# EAGLE schematic esp32_rf (EAGLE 9.6.2)

## Sheet 1 of 3
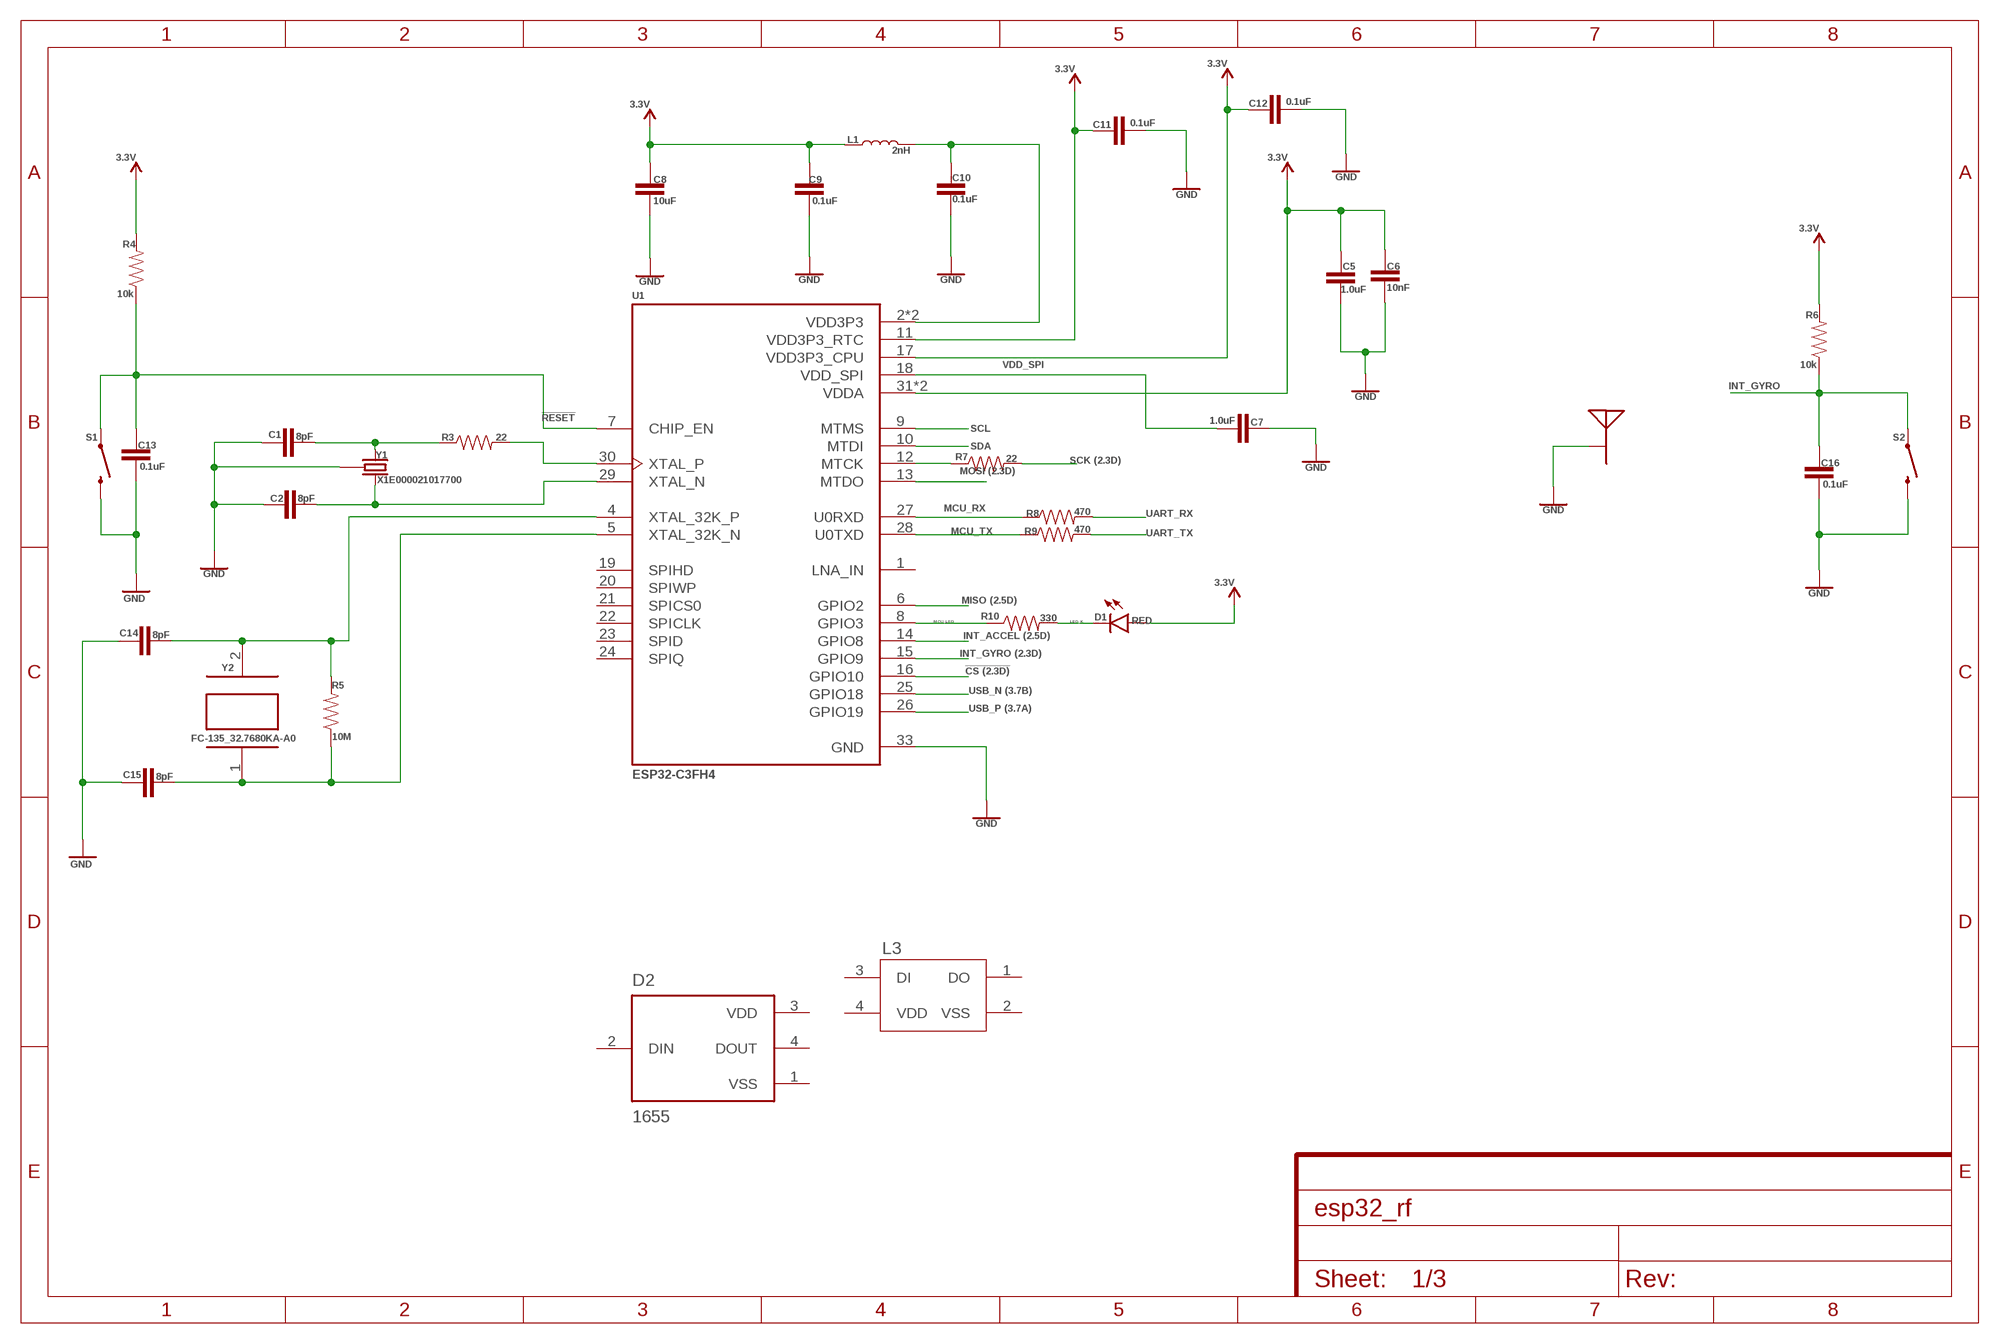
[diagram p0: schematic, sheet 1]

### Parts
C1  8pF  12PF-0603-50V-5%  [0603]
C2  8pF  12PF-0603-50V-5%  [0603]
C5  1.0uF  1.0UF-0603-16V-10%  [0603]
C6  10nF  10NF-0603-50V-10%  [0603]
C7  1.0uF  1.0UF-0603-16V-10%  [0603]
C8  10uF  10UF-0603-6.3V-20%  [0603]
C9  0.1uF  0.1UF-0603-25V-(+80/-20%)  [0603]
C10  0.1uF  0.1UF-0603-25V-(+80/-20%)  [0603]
C11  0.1uF  0.1UF-0603-25V-(+80/-20%)  [0603]
C12  0.1uF  0.1UF-0603-25V-(+80/-20%)  [0603]
C13  0.1uF  0.1UF-0603-25V-(+80/-20%)  [0603]
C14  8pF  12PF-0603-50V-5%  [0603]
C15  8pF  12PF-0603-50V-5%  [0603]
C16  0.1uF  0.1UF-0603-25V-(+80/-20%)  [0603]
D1  RED  LED0603  [LED-0603]
D2  1655  [LED_1655]
L1  2nH  INDUCTOR-0603-33NH  [0603]
L3  WS2812B-2020  [WS2812B-2020]
R3  22  22OHM-0603-1/10W-1%  [0603]
R4  10k  10KOHM-0603-1/10W-1%  [0603]
R5  10M  10MOHM-0603-1/10W-5%  [0603]
R6  10k  10KOHM-0603-1/10W-1%  [0603]
R7  22  22OHM-0603-1/10W-1%  [0603]
R8  470  470OHM-0603-1/10W-1%  [0603]
R9  470  470OHM-0603-1/10W-1%  [0603]
R10  330  330OHM-0603-1/10W-1%  [0603]
S1  MOMENTARY-SWITCH-SPST-SMD-4.6X2.8MM  [TACTILE_SWITCH_SMD_4.6X2.8MM]
S2  MOMENTARY-SWITCH-SPST-SMD-4.6X2.8MM  [TACTILE_SWITCH_SMD_4.6X2.8MM]
U1  ESP32-C3FH4  [QFN50P500X500X90-33N]
U$1  MEANDER-ANT  [MEANDER-ANT]
Y1  X1E000021017700  CRYSTAL-26MHZSMD-3.2X2.5  [CRYSTAL-SMD-3.2X2.5MM]
Y2  FC-135_32.7680KA-A0  [XTAL_FC-135_32.7680KA-A0]

### Nets
3.3V: C5.1 C6.1 C8.1 C9.2 C11.2 C12.2 D1.A L1.1 R4.2 R6.2 U1.11(VDD3P3_RTC) U1.17(VDD3P3_CPU) U1.31(VDDA) U1.32(VDDA) ; also sheet 2,3
!CS: U1.16(GPIO10) ; also sheet 2
!RESET: C13.1 R4.1 S1.1 S1.2 U1.7(CHIP_EN)
GND: C1.1 C2.1 C5.2 C6.2 C7.1 C8.2 C9.1 C10.1 C11.1 C12.1 C13.2 C14.1 C15.1 C16.2 S1.3 S1.4 S2.3 S2.4 U1.33(GND) U$1.GND Y1.2 Y1.4 ; also sheet 2,3
INT_ACCEL: U1.14(GPIO8) ; also sheet 2
INT_GYRO: C16.1 R6.1 S2.1 S2.2 U1.15(GPIO9) ; also sheet 2
LED_K: D1.C R10.2
MCU_LED: R10.1 U1.8(GPIO3)
MCU_RX: R8.1 U1.27(U0RXD)
MCU_TX: R9.1 U1.28(U0TXD)
MISO: U1.6(GPIO2) ; also sheet 2
MOSI: U1.13(MTDO) ; also sheet 2
N$3: R3.2 U1.30(XTAL_P)
N$4: C1.2 R3.1 Y1.1
N$5: C2.2 U1.29(XTAL_N) Y1.3
N$6: C10.2 L1.2 U1.2(VDD3P3) U1.3(VDD3P3)
N$12: C14.2 R5.2 U1.4(XTAL_32K_P) Y2.2
N$13: C15.2 R5.1 U1.5(XTAL_32K_N) Y2.1
N$15: R7.1 U1.12(MTCK)
SCK: R7.2 ; also sheet 2
SCL: U1.9(MTMS) ; also sheet 2
SDA: U1.10(MTDI) ; also sheet 2
UART_RX: R8.2 ; also sheet 3
UART_TX: R9.2 ; also sheet 3
USB_N: U1.25(GPIO18) ; also sheet 3
USB_P: U1.26(GPIO19) ; also sheet 3
VDD_SPI: C7.2 U1.18(VDD_SPI)
Unconnected: D2.2(DIN) D2.4(DOUT) L3.1(DO) L3.2(VSS) L3.3(DI) L3.4(VDD) U1.1(LNA_IN) U1.19(SPIHD) U1.20(SPIWP) U1.21(SPICS0) U1.22(SPICLK) U1.23(SPID) U1.24(SPIQ) U$1.FEED

## Sheet 2 of 3
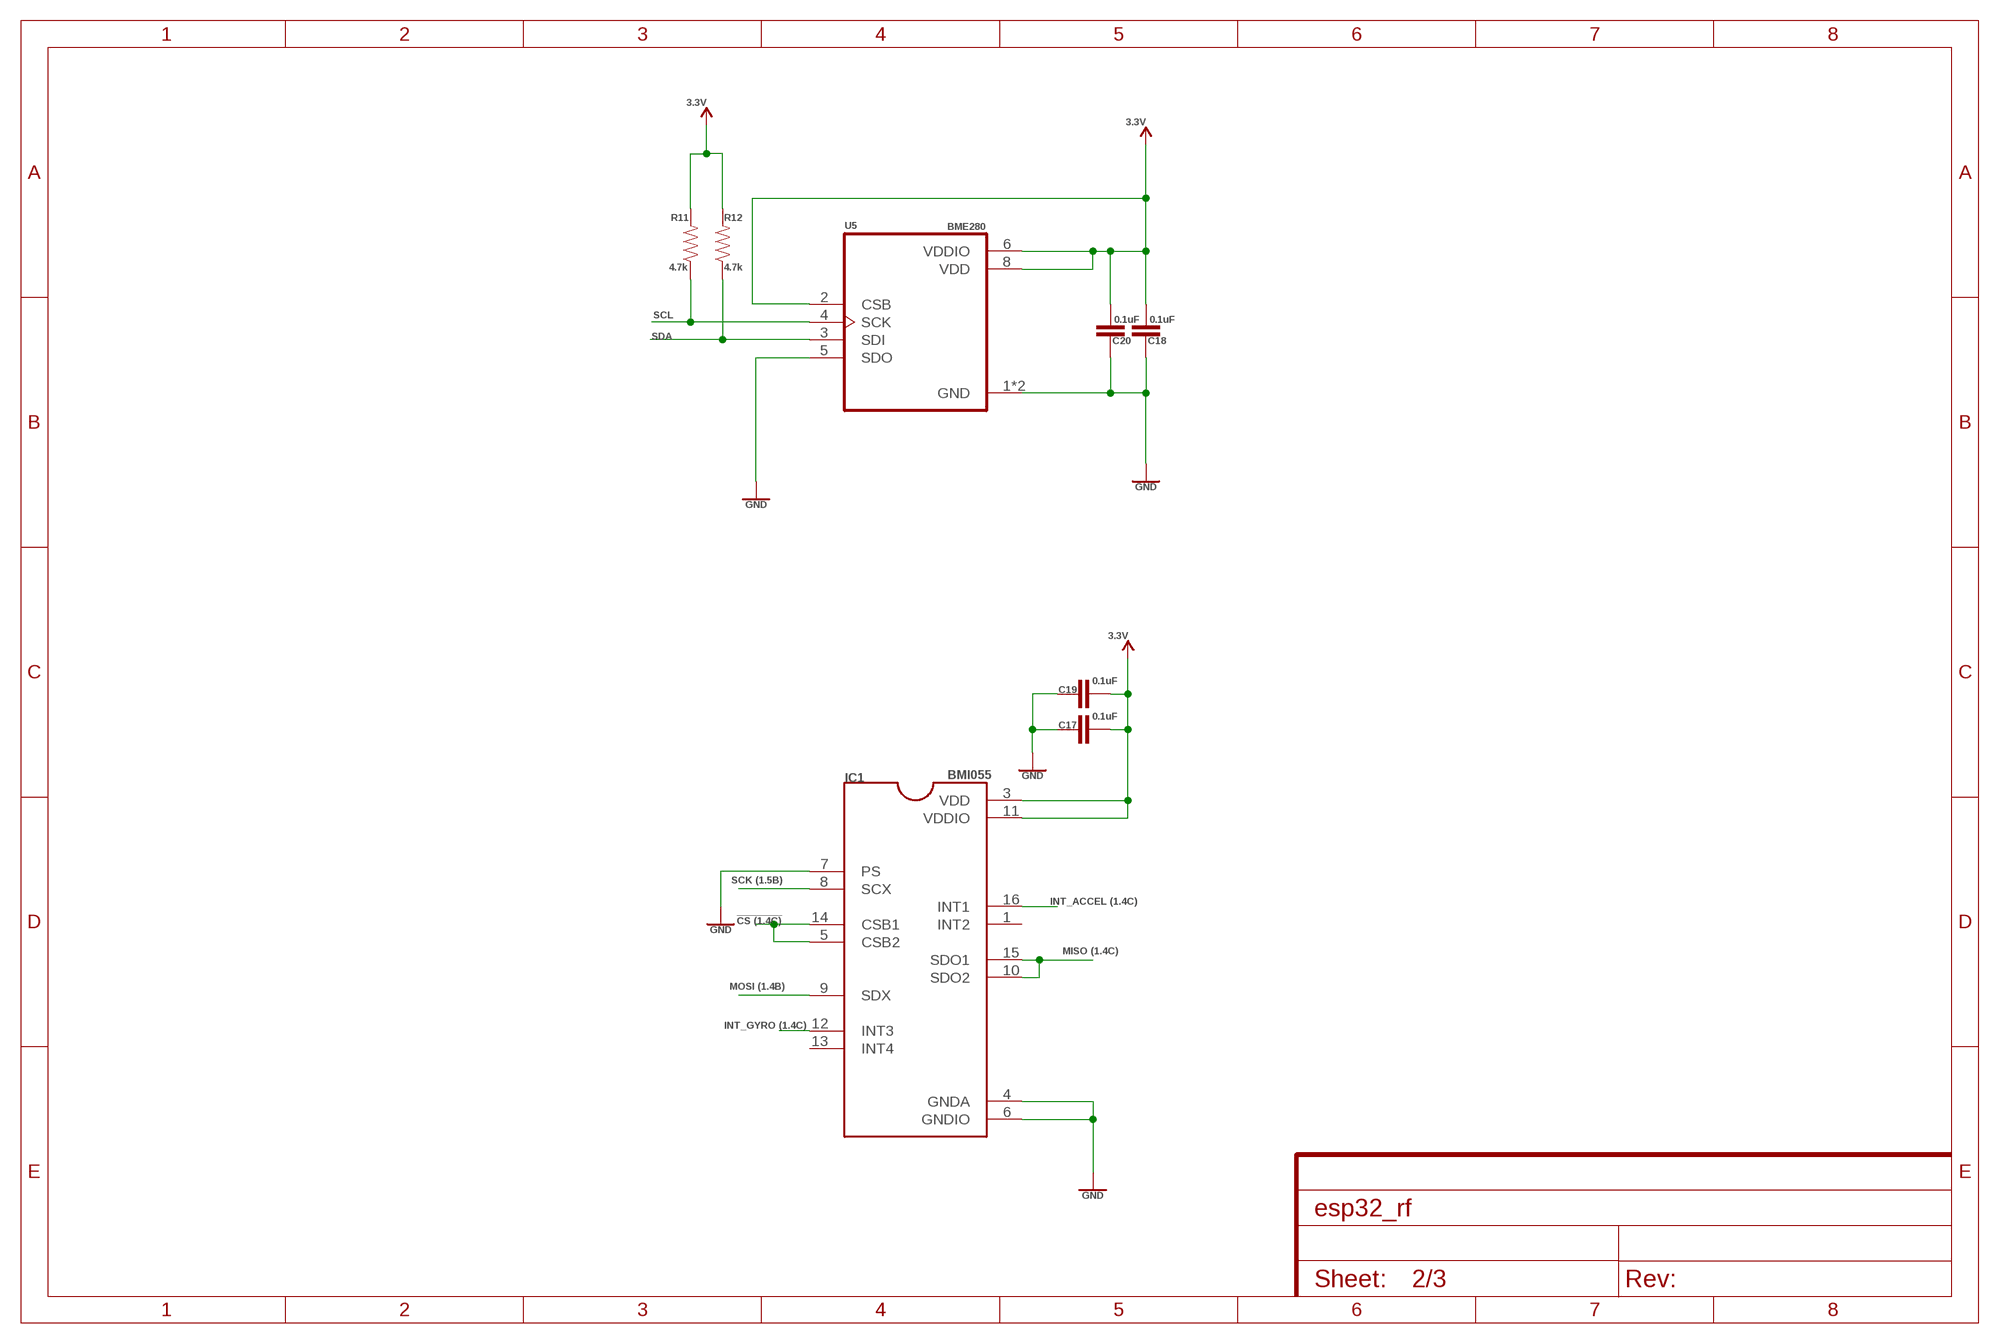
[diagram p1: schematic, sheet 2]

### Parts
C17  0.1uF  0.1UF-0603-25V-(+80/-20%)  [0603]
C18  0.1uF  0.1UF-0603-25V-(+80/-20%)  [0603]
C19  0.1uF  0.1UF-0603-25V-(+80/-20%)  [0603]
C20  0.1uF  0.1UF-0603-25V-(+80/-20%)  [0603]
IC1  BMI055  [QFN50P300X450X100-16N]
R11  4.7k  4.7KOHM-0603-1/10W-1%  [0603]
R12  4.7k  4.7KOHM-0603-1/10W-1%  [0603]
U5  BME280  [PSON65P250X250X100-8N]

### Nets
3.3V: C17.2 C18.2 C19.2 C20.2 IC1.3(VDD) IC1.11(VDDIO) R11.2 R12.2 U5.2(CSB) U5.6(VDDIO) U5.8(VDD) ; also sheet 1,3
!CS: IC1.5(CSB2) IC1.14(CSB1) ; also sheet 1
GND: C17.1 C18.1 C19.1 C20.1 IC1.4(GNDA) IC1.6(GNDIO) IC1.7(PS) U5.1(GND) U5.5(SDO) U5.7(GND) ; also sheet 1,3
INT_ACCEL: IC1.16(INT1) ; also sheet 1
INT_GYRO: IC1.12(INT3) ; also sheet 1
MISO: IC1.10(SDO2) IC1.15(SDO1) ; also sheet 1
MOSI: IC1.9(SDX) ; also sheet 1
SCK: IC1.8(SCX) ; also sheet 1
SCL: R11.1 U5.4(SCK) ; also sheet 1
SDA: R12.1 U5.3(SDI) ; also sheet 1
Unconnected: IC1.1(INT2) IC1.13(INT4)

## Sheet 3 of 3
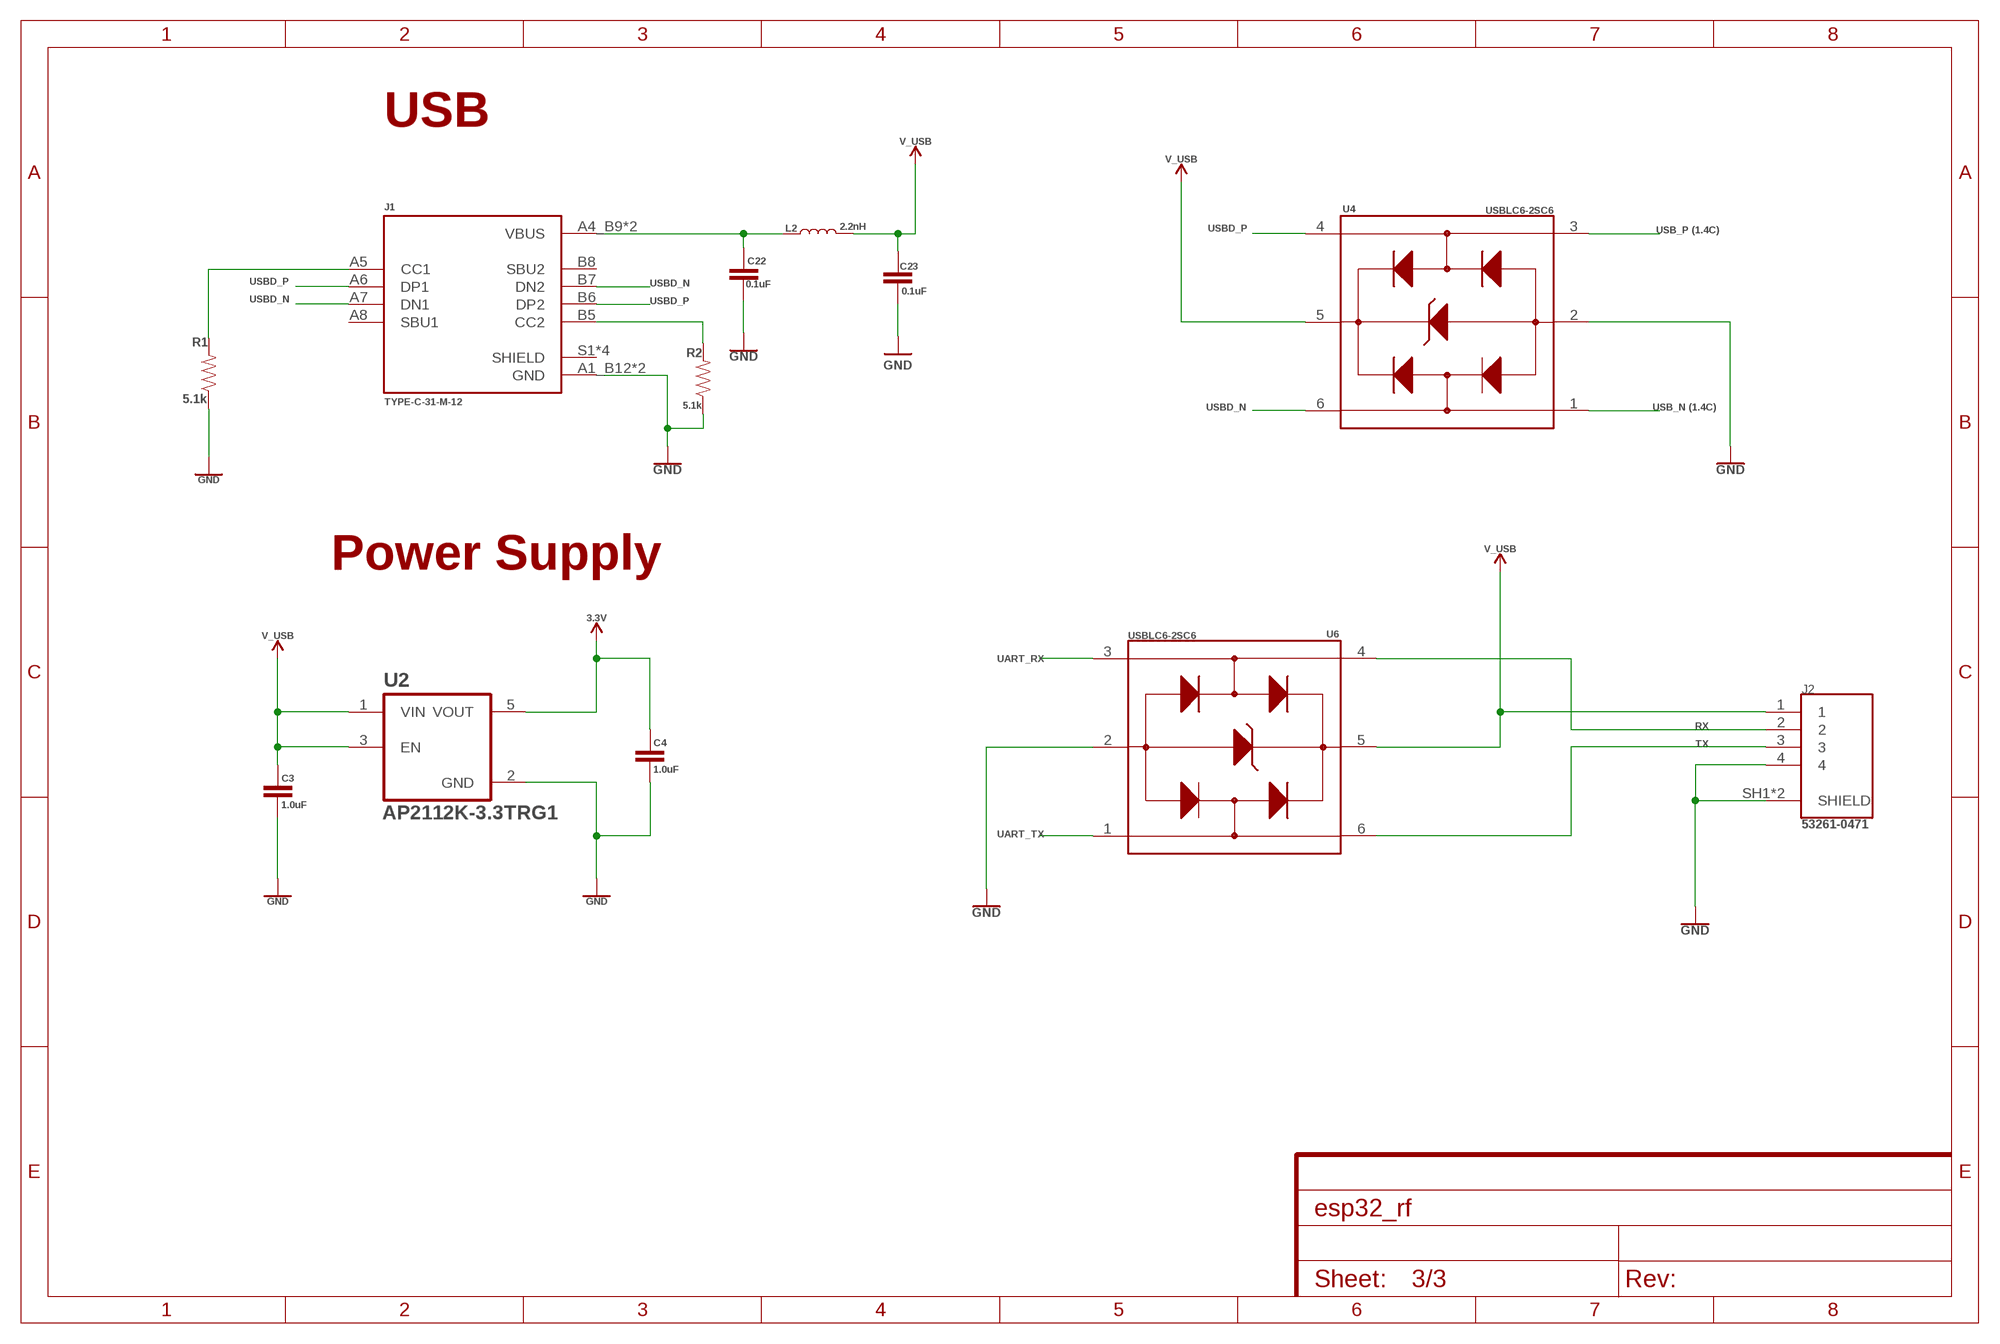
[diagram p2: schematic, sheet 3]

### Parts
C3  1.0uF  1.0UF-0603-16V-10%  [0603]
C4  1.0uF  1.0UF-0603-16V-10%  [0603]
C22  0.1uF  0.1UF-0603-25V-(+80/-20%)  [0603]
C23  0.1uF  0.1UF-0603-25V-(+80/-20%)  [0603]
J1  TYPE-C-31-M-12  [HRO_TYPE-C-31-M-12]
J2  53261-0471  [MOLEX_53261-0471]
L2  2.2nH  INDUCTOR-0603-33NH  [0603]
R1  5.1k  5.6KOHM-0603-1/10W-1%  [0603]
R2  5.1k  5.6KOHM-0603-1/10W-1%  [0603]
U2  AP2112K-3.3TRG1  [SOT95P285X140-5N]
U4  USBLC6-2SC6  [SOT95P280X145-6N]
U6  USBLC6-2SC6  [SOT95P280X145-6N]

### Nets
3.3V: C4.1 U2.5(VOUT) ; also sheet 1,2
GND: C3.2 C4.2 C22.2 C23.2 J1.A1_B12(GND) J1.B1_A12(GND) J2.4 J2.SH1(SHIELD) J2.SH2(SHIELD) R1.1 R2.1 U2.2(GND) U4.2(GND) U6.2(GND) ; also sheet 1,2
N$1: J1.A5(CC1) R1.2
N$2: J1.B5(CC2) R2.2
N$14: C22.1 J1.A4_B9(VBUS) J1.B4_A9(VBUS) L2.1
RX: J2.2 U6.4(I/O2_OUT)
TX: J2.3 U6.6(I/O1_OUT)
UART_RX: U6.3(I/O2_IN) ; also sheet 1
UART_TX: U6.1(I/O1_IN) ; also sheet 1
USB_N: U4.1(I/O1_IN) ; also sheet 1
USB_P: U4.3(I/O2_IN) ; also sheet 1
USBD_N: J1.A7(DN1) J1.B7(DN2) U4.6(I/O1_OUT)
USBD_P: J1.A6(DP1) J1.B6(DP2) U4.4(I/O2_OUT)
V_USB: C3.1 C23.1 J2.1 L2.2 U2.1(VIN) U2.3(EN) U4.5(VBUS) U6.5(VBUS)
Unconnected: J1.A8(SBU1) J1.B8(SBU2) J1.S1(SHIELD) J1.S2(SHIELD) J1.S3(SHIELD) J1.S4(SHIELD)

### Notes on the sheet
- USB
- Power Supply

## Power pins joined to a net without a drawn wire
VDD: D2.3(VDD)
VSS: D2.1(VSS)

## Library data of the parts
C1 C2 C14 C15 = SparkFun-Capacitors:12PF: 12pF ceramic capacitors A capacitor is a passive two-terminal electrical component used to store electrical energy temporarily in an electric field.; PROD_ID: CAP-09137; VALUE: 12pF
C3-C5 C7 = SparkFun-Capacitors:1.0UF: 1µF ceramic capacitors A capacitor is a passive two-terminal electrical component used to store electrical energy temporarily in an electric field.; PROD_ID: CAP-00868
C6 = SparkFun-Capacitors:10NF: 0.01uF/10nF/10,000pF ceramic capacitors A capacitor is a passive two-terminal electrical component used to store electrical energy temporarily in an electric field. CAP-09321; PROD_ID: CAP-00867
C8 = SparkFun-Capacitors:10UF: 10.0µF ceramic capacitors A capacitor is a passive two-terminal electrical component used to store electrical energy temporarily in an electric field.; PROD_ID: CAP-11015
C9-C13 C16-C20 C22 C23 = SparkFun-Capacitors:0.1UF: 0.1µF ceramic capacitors A capacitor is a passive two-terminal electrical component used to store electrical energy temporarily in an electric field.; PROD_ID: CAP-00810
D1 = SparkFun-LED:LED: LED (Generic) Standard schematic elements and footprints for 5mm, 3mm, 1206, and 0603 sized LEDs. Generic LEDs with no color specified.
D2 = 1655:1655: Ws2812b 5050 Rgb Led With Integrated Driver Chip Pack Of 10 Check availability <https://pricing.snapeda.com/parts/1655/Abracon%20LLC/view-part?ref=eda>; AVAILABILITY: In Stock; DESCRIPTION: Addressable Lighting Neopixel 10 LED Discrete Serial (Shift Register) Red, Green, Blue (RGB) 5.00mm L x 5.00mm W; MF: Abracon LLC; MP: 1655; PACKAGE: None; PRICE: None; PURCHASE-URL: https://pricing.snapeda.com/search/part/1655/?ref=eda
IC1 = BMI055:BMI055: BMI055 6 Axis Inertial Sensor (12 Bit Acceleration Sensor + Gyroscope) 3 x 4 mm Check availability <https://pricing.snapeda.com/parts/BMI055/Bosch/view-part?ref=eda>; AVAILABILITY: In Stock; DESCRIPTION: BMI055 series Accelerometer, Gyroscope, 6 Axis Sensor Evaluation Board; MF: Bosch; MP: BMI055; PACKAGE: LGA-16 Bosch; PRICE: None; PURCHASE-URL: https://pricing.snapeda.com/search/part/BMI055/?ref=eda
J1 = TYPE-C-31-M-12:TYPE-C-31-M-12: Check availability <https://pricing.snapeda.com/parts/TYPE-C-31-M-12/HRO%20Electronics%20Co.%2C%20Ltd./view-part?ref=eda>; AVAILABILITY: Not in stock; DESCRIPTION: USB Connectors 24 Receptacle 1 8.94*7.3mm RoHS; MF: HRO Electronics Co., Ltd.; MP: TYPE-C-31-M-12; PACKAGE: Package; PRICE: None
J2 = 53261-0471:53261-0471: Header Molex 1.25mm Pitch PicoBlade™ Header, Surface Mount, Right Angle, 4 Circuits Check availability <https://pricing.snapeda.com/parts/53261-0471/Molex/view-part?ref=eda>; AVAILABILITY: In Stock; DESCRIPTION: Connector Header Surface Mount, Right Angle 4 position 0.049 (1.25mm); MF: Molex; MP: 53261-0471; PACKAGE: None; PRICE: None; PURCHASE-URL: https://pricing.snapeda.com/search/part/53261-0471/?ref=eda
L1 L2 = SparkFun-Coils:INDUCTOR: Inductors Resist changes in electrical current. Basically a coil of wire. SparkFun Products: SparkFun Load Cell Amplifier - HX711 <https://www.sparkfun.com/products/13879> IOIO-OTG - V2.2 <https://www.sparkfun.com/products/13613>; PROD_ID: NDUC-07874; VALUE: 33nH/±5%/500mA
L3 = WS2812B-2020:WS2812B-2020: A small 2x2mm addressable RGB led Check availability <https://pricing.snapeda.com/parts/WS2812B-2020/WorldSemi/view-part?ref=eda>; AVAILABILITY: Not in stock; DESCRIPTION: Programmable LED; SMD; 2020; RGB; 2x2x0.84mm; 3.7÷5.3V; 2kHz; MF: WorldSemi; MP: WS2812B-2020; PACKAGE: None; PRICE: None
R1 R2 = SparkFun-Resistors:5.6KOHM: 5.6kΩ resistor A resistor is a passive two-terminal electrical component that implements electrical resistance as a circuit element. Resistors act to reduce current flow, and, at the same time, act to lower voltage levels within circuits. - Wikipedia; PROD_ID: RES-12378; VALUE: 5.6k
R3 R7 = SparkFun-Resistors:22OHM: 22Ω resistor A resistor is a passive two-terminal electrical component that implements electrical resistance as a circuit element. Resistors act to reduce current flow, and, at the same time, act to lower voltage levels within circuits. - Wikipedia; PROD_ID: RES-08698
R4 R6 = SparkFun-Resistors:10KOHM: 10kΩ resistor A resistor is a passive two-terminal electrical component that implements electrical resistance as a circuit element. Resistors act to reduce current flow, and, at the same time, act to lower voltage levels within circuits. - Wikipedia; PROD_ID: RES-00824
R5 = SparkFun-Resistors:10MOHM: RES-09327; PROD_ID: RES-08283
R8 R9 = SparkFun-Resistors:470OHM: 470Ω resistor A resistor is a passive two-terminal electrical component that implements electrical resistance as a circuit element. Resistors act to reduce current flow, and, at the same time, act to lower voltage levels within circuits. - Wikipedia; PROD_ID: RES-07869
R10 = SparkFun-Resistors:330OHM: 330Ω resistor A resistor is a passive two-terminal electrical component that implements electrical resistance as a circuit element. Resistors act to reduce current flow, and, at the same time, act to lower voltage levels within circuits. - Wikipedia; PROD_ID: RES-00818
R11 R12 = SparkFun-Resistors:4.7KOHM: 4.7kΩ resistor A resistor is a passive two-terminal electrical component that implements electrical resistance as a circuit element. Resistors act to reduce current flow, and, at the same time, act to lower voltage levels within circuits. - Wikipedia; PROD_ID: RES-07857
S1 S2 = SparkFun-Switches:MOMENTARY-SWITCH-SPST: Momentary Switch (Pushbutton) - SPST Normally-open (NO) SPST momentary switches (buttons, pushbuttons). Variants PTH-12MM - 12mm square, through-hole Momentary Pushbutton Switch - 12mm Square <https://www.sparkfun.com/products/9190> (COM-09190) PTH-6.0MM, PTH-6.0MM-KIT - 6.0mm square, through-hole Mini Pushbutton Switch <https://www.sparkfun.com/products/97> (COM-00097) KIT package intended for soldering kit's - only one side of pads' copper is exposed. PTH-RIGHT-ANGLE-KIT - Right-angle, through-hole Right Angle Tactile Button <https://www.sparkfun.com/products/10791> - Used on SparkFun BigTime Watch Kit <https://www.sparkfun.com/products/11734> SMD-12MM - 12mm square, surface-mount Tactile Button - SMD (12mm) <https://www.sparkfun.com/products/12993> (COM-12993) Used on SparkFun PicoBoard <https://www.sparkfun.com/products/11888> SMD-4.5MM - 4.5mm Square Trackball Switch Used on SparkFun Blackberry Trackballer Breakout <https://www.sparkfun.com/products/13169> SMD-4.6MMX2.8MM - 4.60mm x 2.80mm, surface mount Used on SparkFun SAMD21 Mini Breakout <https://www.sparkfun.com/products/13664> SMD-5.2MM, SMD-5.2-REDUNDANT - 5.2mm square, surface-mount Mini Pushbutton Switch - SMD <https://www.sparkfun.com/products/8720> (COM-08720) Used on Arduino Pro Mini <https://www.sparkfun.com/products/11114> REDUNDANT package connects both switch circuits together SMD-6.0X3.5MM - 6.0 x 3.5mm, surface mount Momentary Reset Switch SMD <https://www.sparkfun.com/products/8229> (COM-08229) SMD-6.2MM-TALL - 6.2mm square, surface mount Tactile Button - SMD (6mm) <https://www.sparkfun.com/products/12992> Used on SparkFun Digital Sandbox <https://www.sparkfun.com/products/12651> SMD-RIGHT-ANGLE - Right-angle, surface mount Used on SparkFun Block for Intel® Edison - Arduino <https://www.sparkfun.com/products/13036>; PROD_ID: SWCH-13065
U1 = ESP32-C3FH4:ESP32-C3FH4: Check availability <https://pricing.snapeda.com/parts/ESP32-C3FH4/Espressif%20Systems/view-part?ref=eda>; AVAILABILITY: In Stock; DESCRIPTION: Bluetooth, WiFi 802.11b/g/n, Bluetooth v5.0 Transceiver Module 2.402GHz ~ 2.48GHz Antenna Not Included Surface Mount; MF: Espressif Systems; MP: ESP32-C3FH4; PACKAGE: VFQFN-32 Espressif Systems; PRICE: None; PURCHASE-URL: https://pricing.snapeda.com/search/part/ESP32-C3FH4/?ref=eda
U2 = AP2112K-3.3TRG1:AP2112K-3.3TRG1: AP2112 Series 0.6 A 3.3 V Fixed Output SMT LDO Linear Regulator - SOT23-5 Check availability <https://pricing.snapeda.com/parts/AP2112K-3.3TRG1/Diodes%20Inc./view-part?ref=eda>; AVAILABILITY: In Stock; DESCRIPTION: Linear Voltage Regulator IC Positive Fixed 1 Output 600mA SOT-25; MF: Diodes Inc.; MP: AP2112K-3.3TRG1; PACKAGE: SOT-753 Diodes Inc.; PRICE: None; PURCHASE-URL: https://pricing.snapeda.com/search/part/AP2112K-3.3TRG1/?ref=eda
U4 U6 = USBLC6-2SC6:USBLC6-2SC6: Check availability <https://pricing.snapeda.com/parts/USBLC6-2SC6/STMicroelectronics/view-part?ref=eda> Check availability <https://pricing.snapeda.com/parts/USBLC6-2SC6/STMicroelectronics/view-part?ref=eda> Check availability <https://pricing.snapeda.com/parts/USBLC6-2SC6/STMicroelectronics/view-part?ref=eda>; AVAILABILITY: In Stock; DESCRIPTION: 17V Clamp 5A (8/20µs) Ipp Tvs Diode Surface Mount SOT-23-6; MF: STMicroelectronics; MP: USBLC6-2SC6; PACKAGE: SOT-23-6 STMicroelectronics; PRICE: None; PURCHASE-URL: https://pricing.snapeda.com/search/part/USBLC6-2SC6/?ref=eda
U5 = BME280:BME280: DIGITAL HUMIDITY, PRESSURE AND TEMPERATURE SENSOR * Digital interface I²C (up to 3.4 MHz) and SPI (3 and 4 wire, up to 10 MHz)* Supply voltage VDD main supply voltage range: 1.71 V to 3.6 V*VDDIO interface voltage range: 1.2 V to 3.6 V Operating range -40…+85 °C, 0…100 % rel. humidity, 300…1100 hPa The library has been designed by Richard Magdycz <https://www.facebook.com/groups/eaglecadsoftUK> Check availability <https://pricing.snapeda.com/parts/BME280/Bosch/view-part?ref=eda>; AVAILABILITY: In Stock; DESCRIPTION: Board Mount Humidity Sensors MEMS humidity, pressure and temperature sensor; MF: Bosch; MP: BME280; PACKAGE: LGA-8 Bosch; PRICE: None; PURCHASE-URL: https://pricing.snapeda.com/search/part/BME280/?ref=eda
U$1 = Antennas:MEANDER-ANT
Y1 = SparkFun-Clocks:CRYSTAL-26MHZ: 26MHz Crystal w/ Ground Pin Digikey Example <http://www.digikey.com/product-detail/en/epson/TSX-3225%2026.0000MF09Z-AC3/SER3627CT-ND/1802878> Frequency: 26MHz Frequency Stability: ±9ppm Frequency Tolerance: ±10ppm Load Capacitance: 9pF SparkFun Products: SparkFun ESP32 Thing <https://www.sparkfun.com/products/13907> SparkFun ESP8266 Thing Dev Board <https://www.sparkfun.com/products/13711>; PROD_ID: XTAL-12454
Y2 = FC-135_32.7680KA-A0:FC-135_32.7680KA-A0: None Check availability <https://pricing.snapeda.com/parts/FC-135%2032.7680KA-A0/EPSON/view-part?ref=eda>; AVAILABILITY: In Stock; DESCRIPTION: 32.768 kHz ±20ppm Crystal 12.5pF 70 kOhms 2-SMD, No Lead; MF: EPSON; MP: FC-135 32.7680KA-A0; PACKAGE: SMD-2 Epson; PRICE: None; PURCHASE-URL: https://pricing.snapeda.com/search/part/FC-135 32.7680KA-A0/?ref=eda